# EAGLE schematic mux (EAGLE 7.1.0)
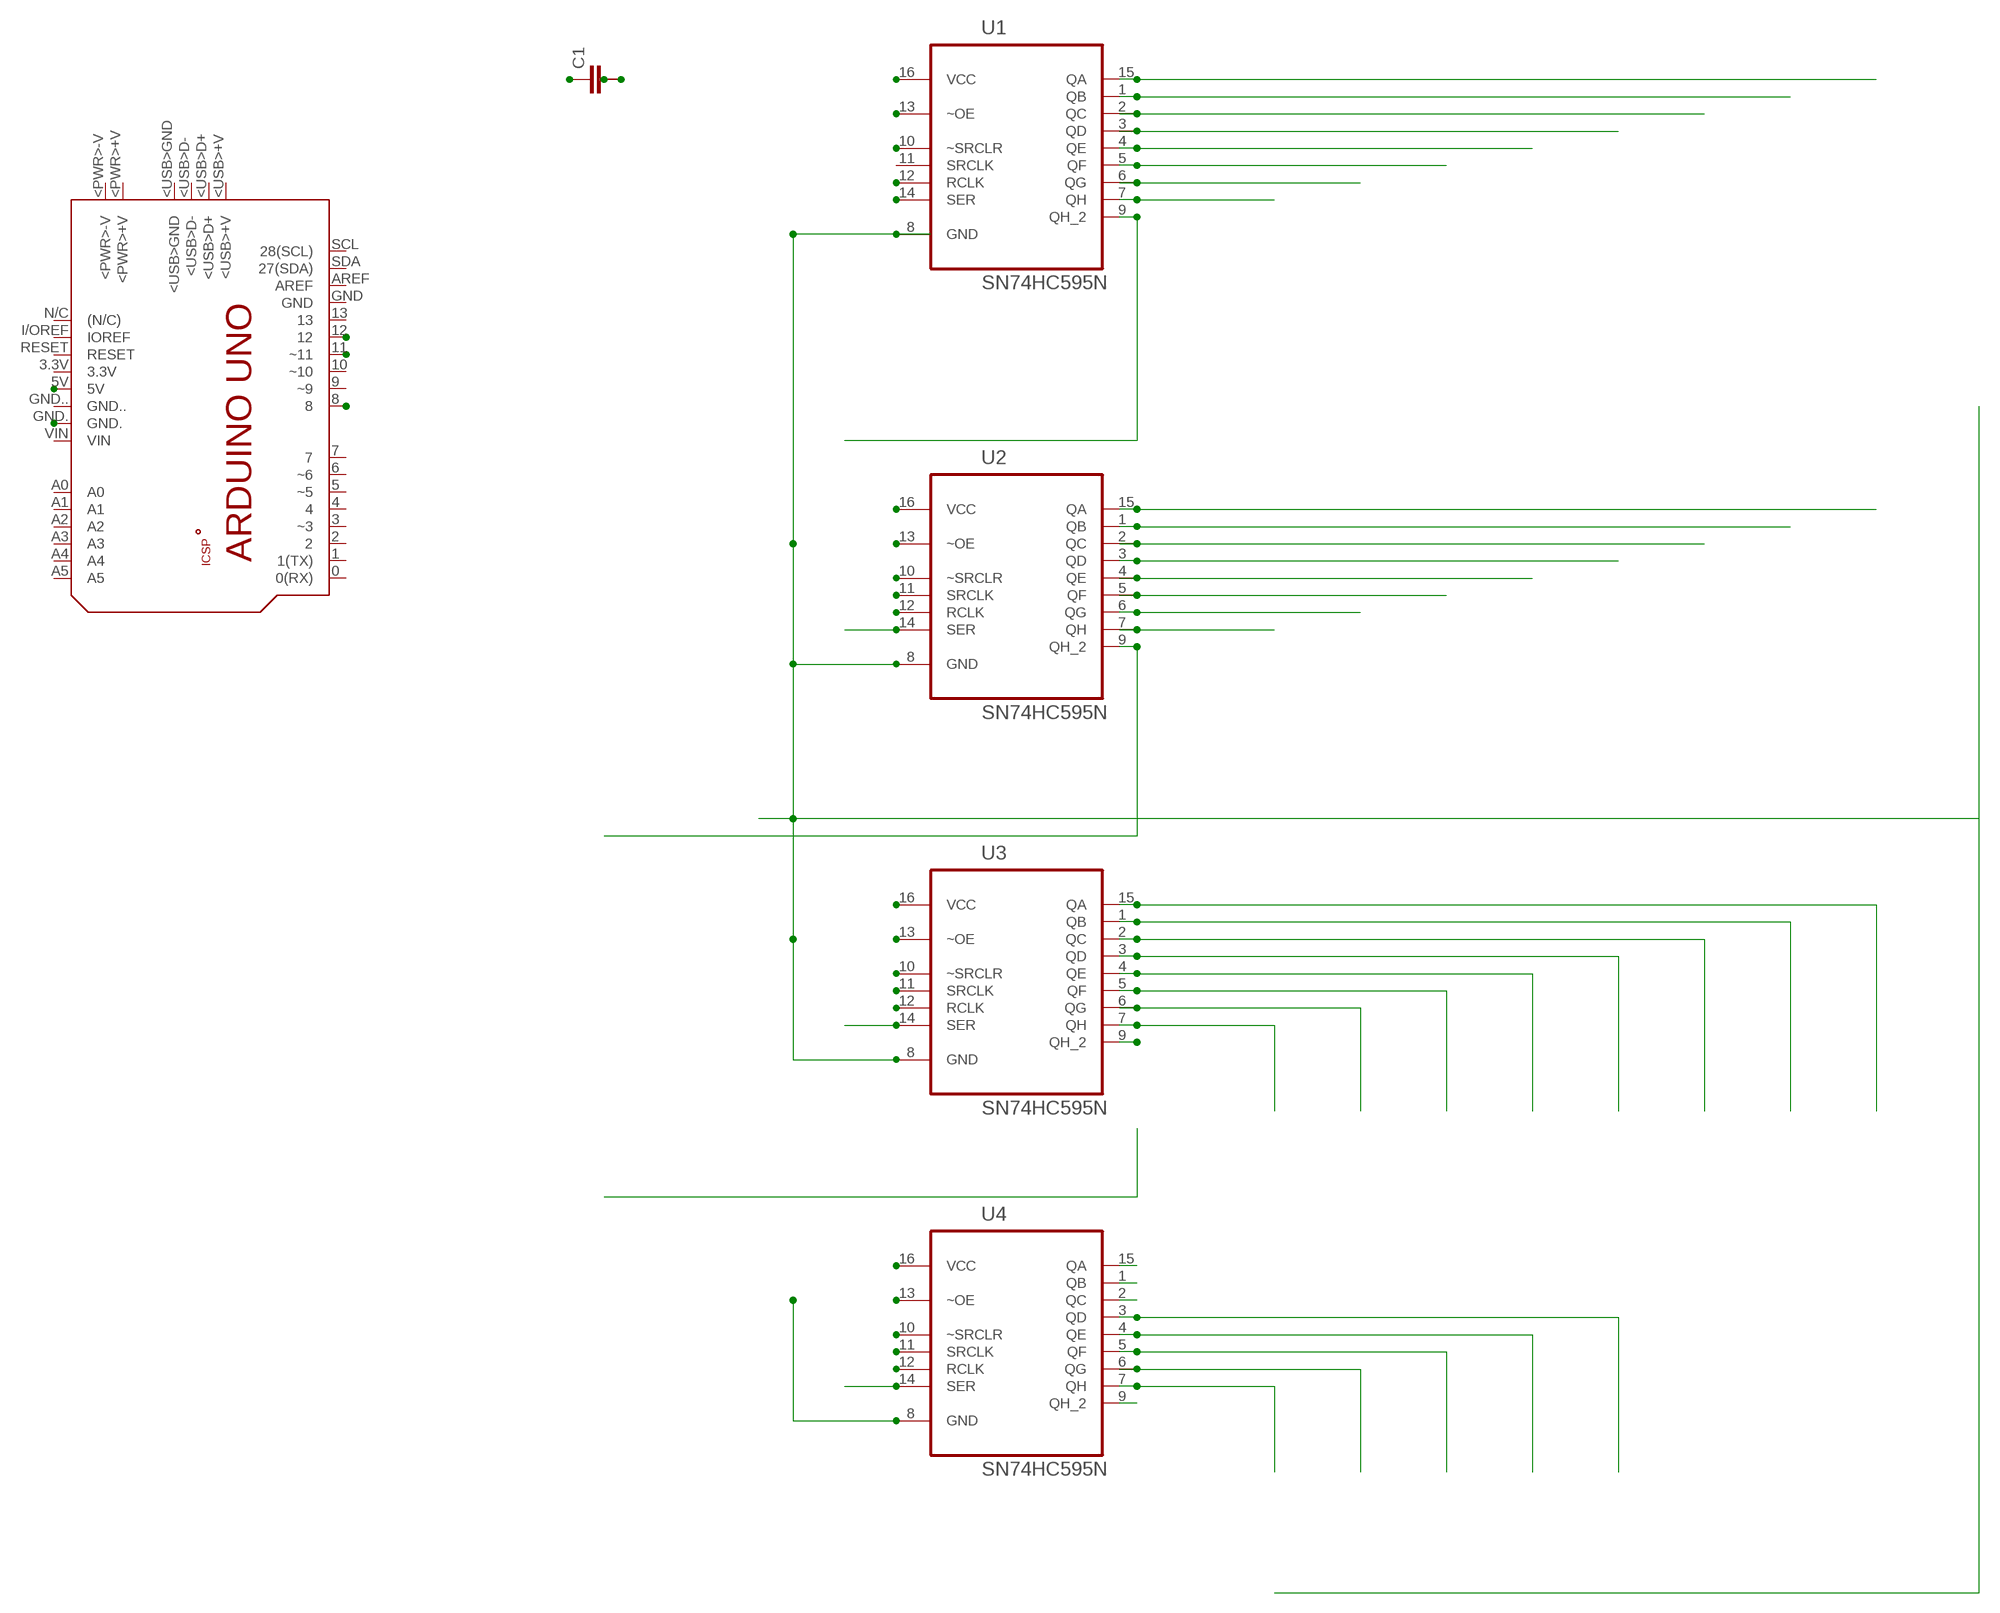
[diagram p0: schematic, sheet 1]

## Parts
C1  C-10-15/6  [C10-15B6]
PCB1  ARDUINO_UNO  [ARDUINO_UNO]
U1  SN74HC595N  [DIP254P762X508-16]
U2  SN74HC595N  [DIP254P762X508-16]
U3  SN74HC595N  [DIP254P762X508-16]
U4  SN74HC595N  [DIP254P762X508-16]

## Nets
CW_W: U2.1(QB)
N$6: PCB1.GND.
N$22: U4.8(GND)
N$25: U1.9(QH_2)
N$26: PCB1.8
N$27: U2.4(QE)
N$28: U2.9(QH_2)
N$29: U2.2(QC)
N$30: PCB1.11(~11)
N$31: U2.15(QA)
N$32: U2.3(QD)
N$33: U2.6(QG)
N$34: U2.7(QH)
N$35: U3.4(QE)
N$36: U2.5(QF)
N$37: U3.6(QG)
N$38: U3.5(QF)
N$39: U3.3(QD)
N$40: U3.2(QC)
N$41: U3.1(QB)
N$42: U3.15(QA)
N$43: U3.7(QH)
N$44: U1.15(QA)
N$45: U3.9(QH_2)
N$46: U2.16(VCC)
N$47: U3.16(VCC)
N$48: U1.16(VCC)
N$49: PCB1.5V
N$50: C1.1
N$51: C1.2
N$52: U1.7(QH)
N$53: U1.6(QG)
N$54: U1.5(QF)
N$55: U1.4(QE)
N$56: U1.3(QD)
N$57: U1.1(QB)
N$58: U1.2(QC)
N$59: C1.3
N$60: U1.13(~OE)
N$61: U2.13(~OE)
N$62: U3.13(~OE)
N$63: U3.10(~SRCLR)
N$64: U2.10(~SRCLR)
N$65: U1.10(~SRCLR)
N$66: U2.14(SER)
N$67: U3.14(SER)
N$68: U3.11(SRCLK)
N$69: U2.12(RCLK)
N$70: U1.14(SER)
N$71: U3.12(RCLK)
N$72: U1.12(RCLK)
N$77: PCB1.12
N$80: U1.8(GND) U2.8(GND) U3.8(GND)
N$81: U4.6(QG)
N$82: U4.5(QF)
N$83: U4.3(QD)
N$84: U4.2(QC)
N$85: U4.1(QB)
N$86: U4.15(QA)
N$87: U4.4(QE)
N$88: U4.7(QH)
N$90: U4.9(QH_2)
N$91: U4.16(VCC)
N$92: U4.13(~OE)
N$93: U4.10(~SRCLR)
N$94: U4.14(SER)
N$95: U4.11(SRCLK)
N$96: U4.12(RCLK)
Unconnected: PCB1.0(0(RX)) PCB1.1(1(TX)) PCB1.2 PCB1.3(~3) PCB1.3.3V PCB1.4 PCB1.5(~5) PCB1.6(~6) PCB1.7 PCB1.9(~9) PCB1.10(~10) PCB1.13 PCB1.+5V PCB1.<PWR>+V PCB1.<PWR>-V PCB1.<USB>+V PCB1.<USB>D+ PCB1.<USB>D- PCB1.<USB>GND PCB1.A0 PCB1.A1 PCB1.A2 PCB1.A3 PCB1.A4 PCB1.A5 PCB1.AREF PCB1.GND PCB1.GND.. PCB1.GND_ PCB1.I/OREF(IOREF) PCB1.MISO PCB1.MOSI PCB1.N/C((N/C)) PCB1.RESET PCB1.RESET. PCB1.SCK PCB1.SCL(28(SCL)) PCB1.SDA(27(SDA)) PCB1.VIN U1.11(SRCLK) U2.11(SRCLK)

## Library data of the parts
C1 = capacitor-wima:C-: CAPACITOR for alternative placement naming: default grid - extended grid/package width
PCB1 = E14_Arduino_published:ARDUINO_UNO: Device for representing an Arduino Uno board with a footprint in an EAGLE design. Created by Dave Young for Element14. More EAGLE documentation at: http://www.element14.com/community/community/knode/cadsoft_eagle
U1-U4 = SN74HC595N:SN74HC595N: 8-BIT SHIFT REGISTERS WITH 3-STATE OUTPUT REGISTERS; MPN: SN74HC595N; OC_FARNELL: 9591664; OC_NEWARK: 60K6845; PACKAGE: PDIP-16; SUPPLIER: Texas Instruments